# EAGLE design switch_b_board (EAGLE 8.3.2)
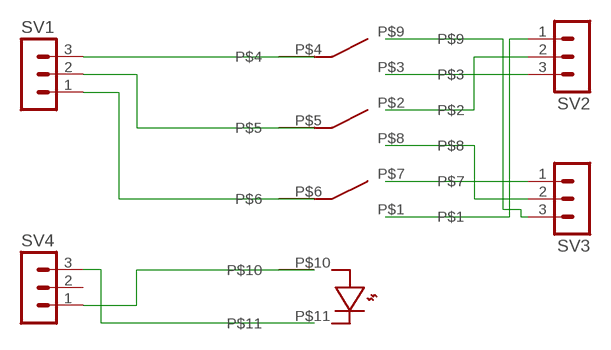
[diagram p0: schematic, sheet 1]

## Parts
SV1  MA03-1  [MA03-1]
SV2  MA03-1  [MA03-1]
SV3  MA03-1  [MA03-1]
SV4  MA03-1  [MA03-1]
U$1  FOOT_SWITCH  [FOOT_SWITCH]

## Nets
N$1: SV1.1 U$1.P$6
N$2: SV1.2 U$1.P$5
N$3: SV1.3 U$1.P$4
N$4: SV2.1 U$1.P$1
N$5: SV2.3 U$1.P$3
N$6: SV2.2 U$1.P$2
N$7: SV3.3 U$1.P$9
N$8: SV3.1 U$1.P$7
N$9: SV3.2 U$1.P$8
N$10: SV4.1 U$1.P$10
N$11: SV4.3 U$1.P$11
Unconnected: SV4.2

## Library data of the parts
SV1-SV4 = con-lstb:MA03-1: PIN HEADER; OC_FARNELL: unknown; OC_NEWARK: unknown
U$1 = untitled:FOOT_SWITCH

## Board
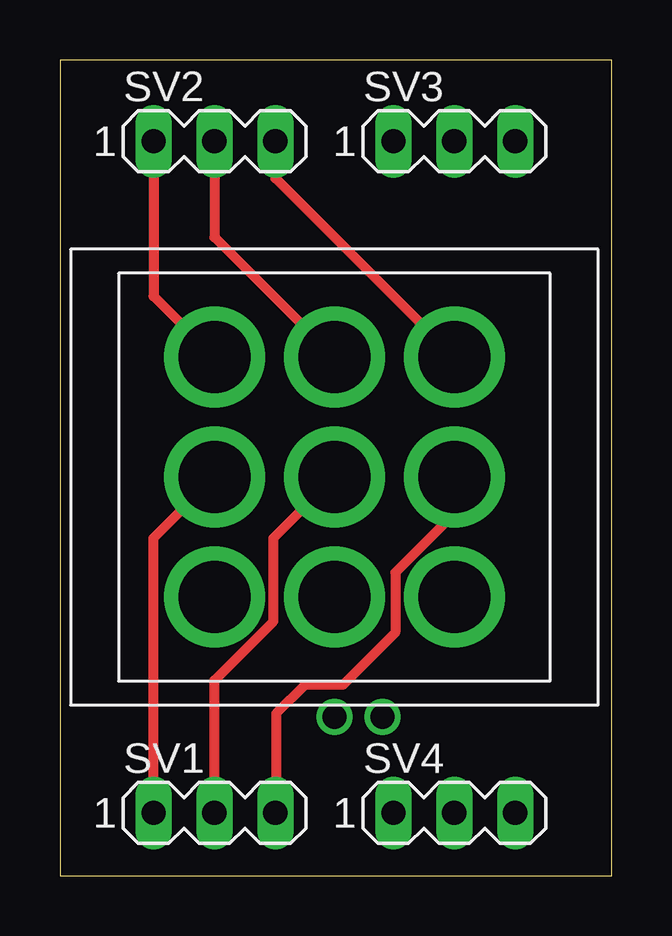
[diagram p1: board, top side]
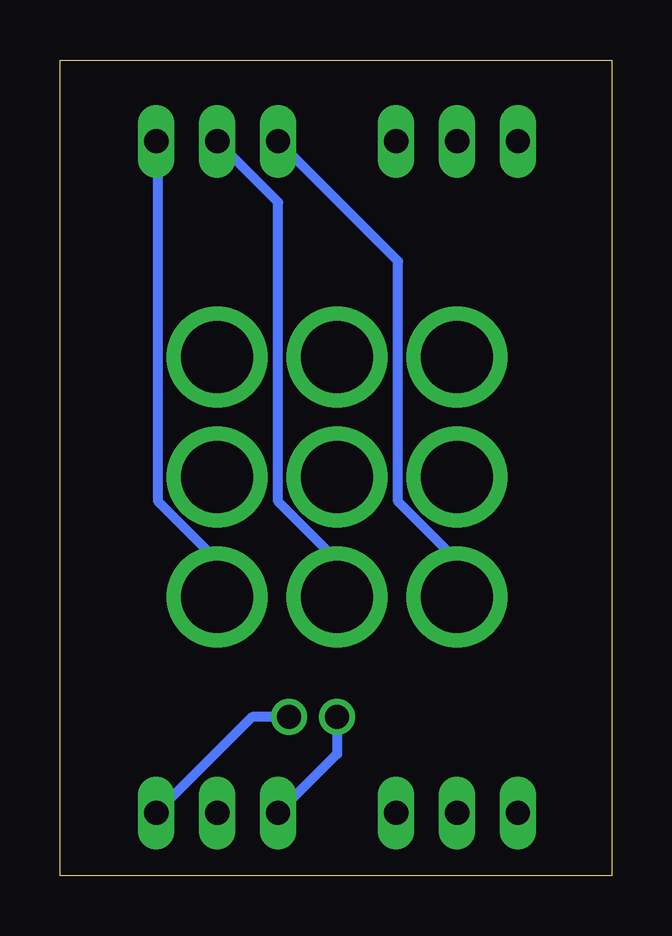
[diagram p2: board, bottom side, seen from below]

Size 23 x 34 mm. Coordinates in mm from the lower left corner, seen from the top.
Outline: 0,0 23,0 23,34 0,34 0,0
Copper layers (1*16): Top 0.035mm / dielectric 1.5mm / Bottom 0.035mm
Design rules "default": minimum track width 6mil, minimum drill 0.35mm, track to track 6mil, track to pad 6mil, pad to pad 6mil, via to via 6mil, smd to smd 6mil, copper to edge 40mil, drill to drill 6mil, minimum pad ring 10mil, minimum via ring 8mil, stop-mask expansion 4mil, vias tented up to drill 0mil, thermal gap 10mil

### Footprints (pad centres in the part's own frame; a part is rotated, then mirrored left to right if it is on the bottom)
MA03-1 = drill 1.016 long: 1 -2.54,0; 2 0,0; 3 2.54,0
FOOT_SWITCH = drill 3 pad 4.2: P$1 -5,5; P$2 0,5; P$3 5,5; P$4 5,0; P$5 0,0; P$6 -5,0; P$7 -5,-5; P$8 0,-5; P$9 5,-5 | drill 1: P$10 0,-10; P$11 2,-10

### Placement (x,y rotation side)
SV1  6.44,2.61 0 top
SV2  6.44,30.61 0 top
SV3  16.44,30.61 0 top
SV4  16.44,2.61 0 top
U$1  11.44,16.61 0 top

### Tracks (layer width: path | path; a pad name or v marks a point on that pad's centre or on a via)
N$1
  Top 0.406: SV1.1 3.9,14.07 U$1.P$6
N$2
  Top 0.406: SV1.2 6.44,8.14 8.9,10.6 8.9,14.07 U$1.P$5
N$3
  Top 0.406: U$1.P$4 16.44,15.09 13.99,12.63 13.99,10.13 11.81,7.95 10.21,7.95 9.02,6.76 9.02,2.65 SV1.3
N$4
  Top 0.406: SV2.1 3.9,24.15 U$1.P$1
N$5
  Top 0.406: SV2.3 8.98,29.07 U$1.P$3
N$6
  Top 0.406: SV2.2 6.44,26.61 U$1.P$2
N$7
  Bottom 0.406: U$1.P$9 16.44,13.14 18.9,15.6 18.9,30.53 SV3.3
N$8
  Bottom 0.406: U$1.P$7 6.44,13.14 8.9,15.6 8.9,25.61 SV3.1
N$9
  Bottom 0.406: U$1.P$8 11.44,13.14 13.9,15.6 13.9,28.07 SV3.2
N$10
  Bottom 0.406: U$1.P$10 11.44,5.07 SV4.1
N$11
  Bottom 0.406: U$1.P$11 14.98,6.61 SV4.3